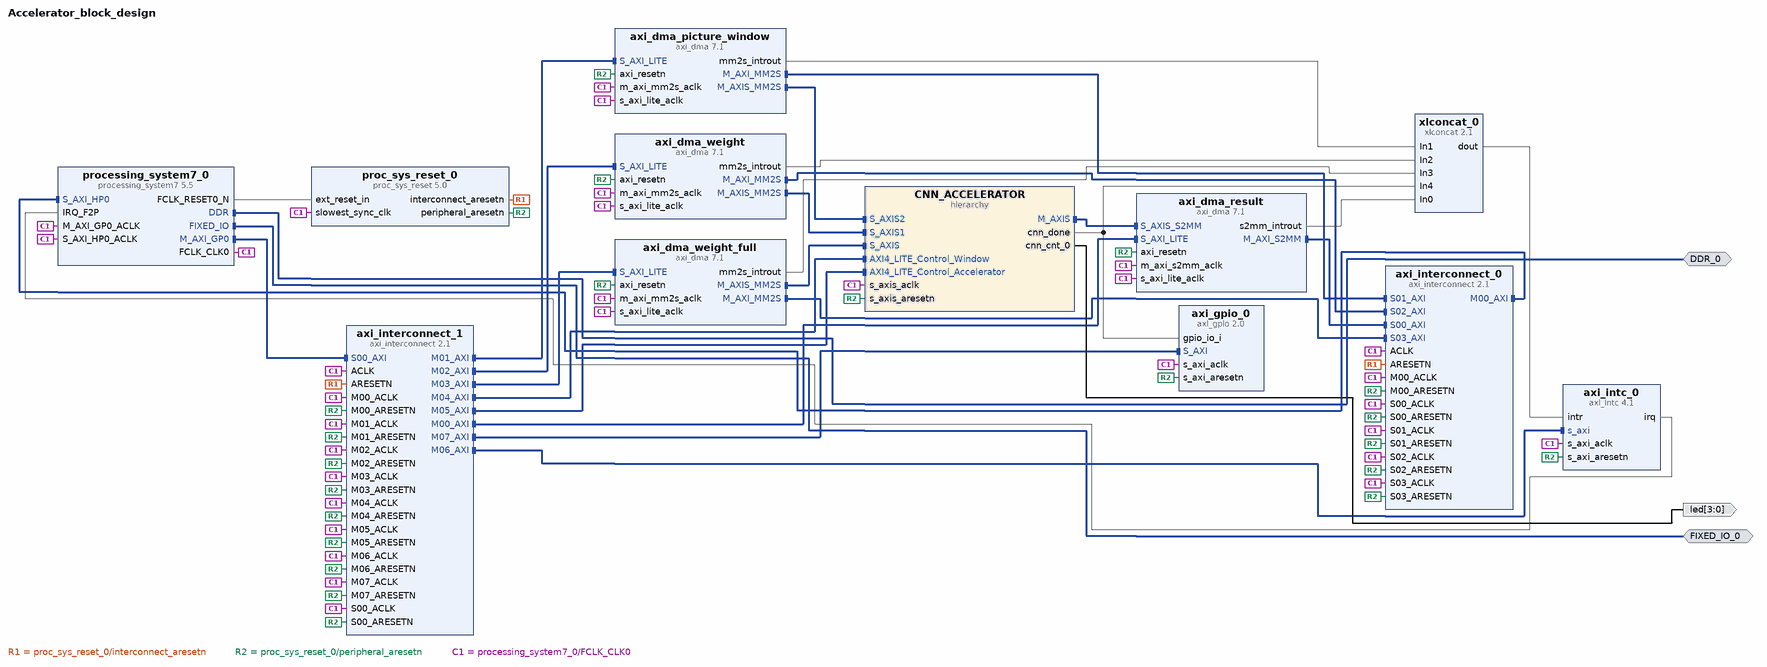
[diagram p0: block diagram of the top level]
# Vivado block design Accelerator_block_design, xc7z020clg400-1, Vivado 2022.1
create_bd_design Accelerator_block_design

create_bd_intf_port -mode Master -vlnv xilinx.com:interface:ddrx_rtl:1.0 DDR_0
create_bd_intf_port -mode Master -vlnv xilinx.com:display_processing_system7:fixedio_rtl:1.0 FIXED_IO_0
create_bd_port -dir O -from 3 -to 0 led

create_bd_cell -type ip -vlnv xilinx.com:ip:processing_system7:5.5 processing_system7_0
set_property -dict [list \
  CONFIG.PCW_APU_PERIPHERAL_FREQMHZ 666.666666 \
  CONFIG.PCW_ENET0_ENET0_IO {MIO 16 .. 27} \
  CONFIG.PCW_ENET0_GRP_MDIO_ENABLE 1 \
  CONFIG.PCW_ENET0_GRP_MDIO_IO {MIO 52 .. 53} \
  CONFIG.PCW_ENET0_PERIPHERAL_ENABLE 1 \
  CONFIG.PCW_ENET0_RESET_ENABLE 0 \
  CONFIG.PCW_ENET_RESET_ENABLE 1 \
  CONFIG.PCW_ENET_RESET_SELECT {Share reset pin} \
  CONFIG.PCW_FPGA0_PERIPHERAL_FREQMHZ 50 \
  CONFIG.PCW_GPIO_MIO_GPIO_ENABLE 1 \
  CONFIG.PCW_GPIO_MIO_GPIO_IO MIO \
  CONFIG.PCW_I2C_RESET_ENABLE 0 \
  CONFIG.PCW_IRQ_F2P_INTR 1 \
  CONFIG.PCW_PRESET_BANK1_VOLTAGE {LVCMOS 1.8V} \
  CONFIG.PCW_QSPI_GRP_FBCLK_ENABLE 1 \
  CONFIG.PCW_QSPI_GRP_FBCLK_IO {MIO 8} \
  CONFIG.PCW_QSPI_GRP_SINGLE_SS_ENABLE 1 \
  CONFIG.PCW_QSPI_GRP_SINGLE_SS_IO {MIO 1 .. 6} \
  CONFIG.PCW_QSPI_PERIPHERAL_ENABLE 1 \
  CONFIG.PCW_QSPI_QSPI_IO {MIO 1 .. 6} \
  CONFIG.PCW_SD0_GRP_CD_ENABLE 0 \
  CONFIG.PCW_SD0_GRP_WP_ENABLE 0 \
  CONFIG.PCW_SD0_PERIPHERAL_ENABLE 1 \
  CONFIG.PCW_SD0_SD0_IO {MIO 40 .. 45} \
  CONFIG.PCW_SDIO_PERIPHERAL_FREQMHZ 100 \
  CONFIG.PCW_SINGLE_QSPI_DATA_MODE x4 \
  CONFIG.PCW_UART0_PERIPHERAL_ENABLE 1 \
  CONFIG.PCW_UART0_UART0_IO {MIO 14 .. 15} \
  CONFIG.PCW_UART1_PERIPHERAL_ENABLE 0 \
  CONFIG.PCW_UART_PERIPHERAL_FREQMHZ 100 \
  CONFIG.PCW_UIPARAM_DDR_BUS_WIDTH {16 Bit} \
  CONFIG.PCW_UIPARAM_DDR_FREQ_MHZ 525 \
  CONFIG.PCW_UIPARAM_DDR_PARTNO Custom \
  CONFIG.PCW_USB0_PERIPHERAL_ENABLE 1 \
  CONFIG.PCW_USB0_RESET_ENABLE 0 \
  CONFIG.PCW_USB0_USB0_IO {MIO 28 .. 39} \
  CONFIG.PCW_USB_RESET_ENABLE 1 \
  CONFIG.PCW_USB_RESET_SELECT {Share reset pin} \
  CONFIG.PCW_USE_FABRIC_INTERRUPT 1 \
  CONFIG.PCW_USE_S_AXI_HP0 1 \
] [get_bd_cells processing_system7_0]
# 226 more settings of processing_system7_0 are not shown: defaults, MIO pin electricals, DDR timing, and values the tool derives
create_bd_cell -type ip -vlnv xilinx.com:ip:axi_interconnect:2.1 axi_interconnect_0
set_property -dict [list \
  CONFIG.ENABLE_ADVANCED_OPTIONS 1 \
  CONFIG.M00_HAS_DATA_FIFO 0 \
  CONFIG.NUM_MI 1 \
  CONFIG.NUM_SI 4 \
  CONFIG.S00_ARB_PRIORITY 15 \
  CONFIG.S00_HAS_DATA_FIFO 2 \
  CONFIG.S00_HAS_REGSLICE 3 \
  CONFIG.S01_HAS_DATA_FIFO 0 \
  CONFIG.S02_HAS_DATA_FIFO 0 \
  CONFIG.S03_HAS_DATA_FIFO 0 \
  CONFIG.STRATEGY 0 \
  CONFIG.XBAR_DATA_WIDTH 128 \
] [get_bd_cells axi_interconnect_0]
create_bd_cell -type ip -vlnv xilinx.com:ip:axi_interconnect:2.1 axi_interconnect_1
set_property -dict {CONFIG.NUM_MI 8 CONFIG.NUM_SI 1} [get_bd_cells axi_interconnect_1]
create_bd_cell -type ip -vlnv xilinx.com:ip:axi_dma:7.1 axi_dma_result
set_property -dict [list \
  CONFIG.c_include_mm2s 0 \
  CONFIG.c_include_s2mm 1 \
  CONFIG.c_include_sg 0 \
  CONFIG.c_m_axis_mm2s_tdata_width 32 \
  CONFIG.c_s2mm_burst_size 64 \
  CONFIG.c_sg_length_width 26 \
  CONFIG.c_sg_use_stsapp_length 0 \
] [get_bd_cells axi_dma_result]
create_bd_cell -type ip -vlnv xilinx.com:ip:axi_dma:7.1 axi_dma_picture_window
set_property -dict [list \
  CONFIG.c_include_mm2s 1 \
  CONFIG.c_include_s2mm 0 \
  CONFIG.c_include_sg 0 \
  CONFIG.c_m_axis_mm2s_tdata_width 8 \
  CONFIG.c_mm2s_burst_size 8 \
  CONFIG.c_sg_length_width 16 \
] [get_bd_cells axi_dma_picture_window]
create_bd_cell -type ip -vlnv xilinx.com:ip:axi_dma:7.1 axi_dma_weight
set_property -dict [list \
  CONFIG.c_include_mm2s 1 \
  CONFIG.c_include_s2mm 0 \
  CONFIG.c_include_sg 0 \
  CONFIG.c_m_axi_mm2s_data_width 128 \
  CONFIG.c_m_axis_mm2s_tdata_width 64 \
  CONFIG.c_mm2s_burst_size 64 \
  CONFIG.c_sg_length_width 16 \
] [get_bd_cells axi_dma_weight]
create_bd_cell -type ip -vlnv xilinx.com:ip:axi_dma:7.1 axi_dma_weight_full
set_property -dict [list \
  CONFIG.c_include_mm2s 1 \
  CONFIG.c_include_s2mm 0 \
  CONFIG.c_include_sg 0 \
  CONFIG.c_m_axi_mm2s_data_width 128 \
  CONFIG.c_m_axis_mm2s_tdata_width 64 \
  CONFIG.c_mm2s_burst_size 64 \
  CONFIG.c_sg_length_width 16 \
] [get_bd_cells axi_dma_weight_full]
create_bd_cell -type ip -vlnv xilinx.com:ip:proc_sys_reset:5.0 proc_sys_reset_0
create_bd_cell -type ip -vlnv xilinx.com:ip:xlconcat:2.1 xlconcat_0
set_property -dict {CONFIG.NUM_PORTS 5} [get_bd_cells xlconcat_0]
create_bd_cell -type hier CNN_ACCELERATOR
create_bd_cell -type ip -vlnv xilinx.com:ip:axi_intc:4.1 axi_intc_0
set_property -dict [list \
  CONFIG.C_IRQ_CONNECTION 1 \
  CONFIG.C_KIND_OF_INTR 0xFFFFFFFF \
  CONFIG.C_NUM_SW_INTR 0 \
  CONFIG.C_S_AXI_ACLK_FREQ_MHZ 100.0 \
] [get_bd_cells axi_intc_0]
create_bd_cell -type ip -vlnv xilinx.com:ip:axi_gpio:2.0 axi_gpio_0
set_property -dict {CONFIG.C_ALL_INPUTS 1 CONFIG.C_GPIO_WIDTH 1 CONFIG.C_INTERRUPT_PRESENT 1} [get_bd_cells axi_gpio_0]

# ---- hierarchy /CNN_ACCELERATOR ----
current_bd_instance /CNN_ACCELERATOR
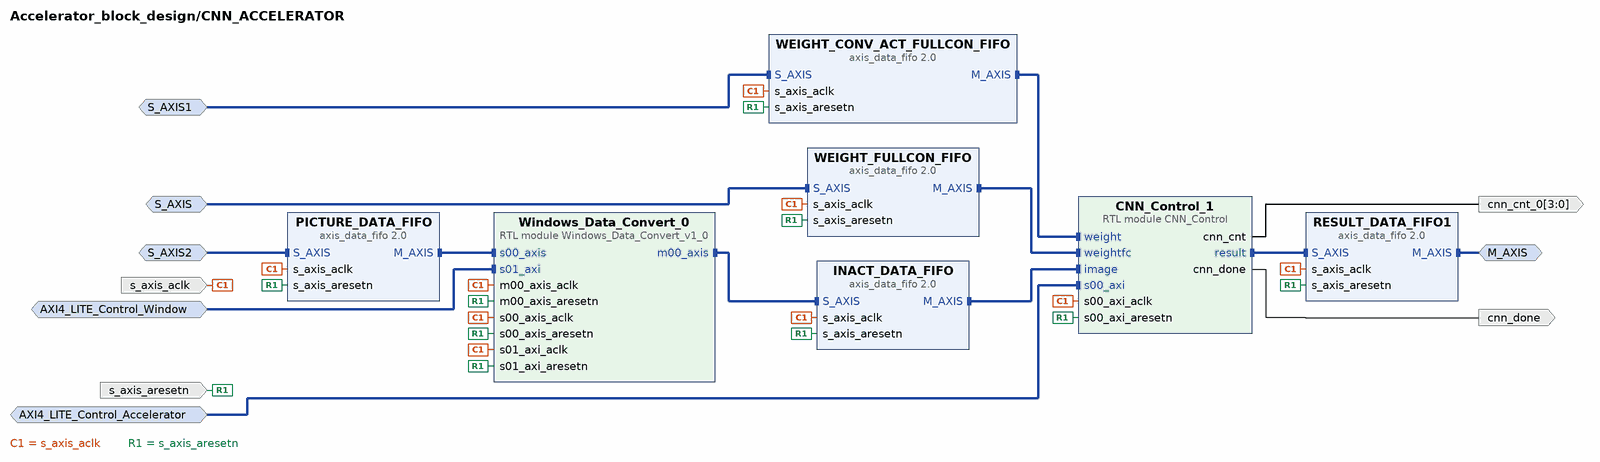
[diagram p1: block diagram inside /CNN_ACCELERATOR]
create_bd_intf_pin -mode Master -vlnv xilinx.com:interface:axis_rtl:1.0 M_AXIS
create_bd_intf_pin -mode Slave -vlnv xilinx.com:interface:aximm_rtl:1.0 AXI4_LITE_Control_Accelerator
create_bd_intf_pin -mode Slave -vlnv xilinx.com:interface:axis_rtl:1.0 S_AXIS
create_bd_intf_pin -mode Slave -vlnv xilinx.com:interface:axis_rtl:1.0 S_AXIS1
create_bd_intf_pin -mode Slave -vlnv xilinx.com:interface:aximm_rtl:1.0 AXI4_LITE_Control_Window
create_bd_intf_pin -mode Slave -vlnv xilinx.com:interface:axis_rtl:1.0 S_AXIS2
create_bd_pin -dir I -type rst s_axis_aresetn
create_bd_pin -dir I -type clk s_axis_aclk
create_bd_pin -dir O cnn_done
create_bd_pin -dir O -from 3 -to 0 cnn_cnt_0

create_bd_cell -type ip -vlnv xilinx.com:ip:axis_data_fifo:2.0 RESULT_DATA_FIFO1
set_property -dict [list \
  CONFIG.FIFO_DEPTH 2048 \
  CONFIG.HAS_TKEEP 0 \
  CONFIG.HAS_TLAST 1 \
  CONFIG.HAS_TSTRB 0 \
  CONFIG.TDATA_NUM_BYTES 32 \
] [get_bd_cells RESULT_DATA_FIFO1]
create_bd_cell -type ip -vlnv xilinx.com:ip:axis_data_fifo:2.0 WEIGHT_FULLCON_FIFO
set_property -dict [list \
  CONFIG.FIFO_DEPTH 512 \
  CONFIG.HAS_TKEEP 1 \
  CONFIG.HAS_TLAST 1 \
  CONFIG.HAS_TSTRB 1 \
  CONFIG.TDATA_NUM_BYTES 8 \
] [get_bd_cells WEIGHT_FULLCON_FIFO]
create_bd_cell -type ip -vlnv xilinx.com:ip:axis_data_fifo:2.0 WEIGHT_CONV_ACT_FULLCON_FIFO
set_property -dict [list \
  CONFIG.FIFO_DEPTH 512 \
  CONFIG.HAS_TKEEP 1 \
  CONFIG.HAS_TLAST 1 \
  CONFIG.HAS_TSTRB 1 \
  CONFIG.TDATA_NUM_BYTES 8 \
] [get_bd_cells WEIGHT_CONV_ACT_FULLCON_FIFO]
create_bd_cell -type ip -vlnv xilinx.com:ip:axis_data_fifo:2.0 INACT_DATA_FIFO
set_property -dict [list \
  CONFIG.FIFO_DEPTH 1024 \
  CONFIG.HAS_TKEEP 1 \
  CONFIG.HAS_TLAST 1 \
  CONFIG.HAS_TSTRB 1 \
  CONFIG.TDATA_NUM_BYTES 25 \
] [get_bd_cells INACT_DATA_FIFO]
create_bd_cell -type ip -vlnv xilinx.com:ip:axis_data_fifo:2.0 PICTURE_DATA_FIFO
set_property -dict {CONFIG.FIFO_DEPTH 1024} [get_bd_cells PICTURE_DATA_FIFO]
create_bd_cell -type module -reference Windows_Data_Convert_v1_0 Windows_Data_Convert_0
set_property -dict [list \
  CONFIG.AXIS_TDATA_WIDTH 8 \
  CONFIG.DATA_HORIZONTAL 28 \
  CONFIG.DATA_VERTICAL 28 \
  CONFIG.KERNEL_SIZE 5 \
] [get_bd_cells Windows_Data_Convert_0]
create_bd_cell -type module -reference CNN_Control CNN_Control_1
set_property -dict [list \
  CONFIG.CONV_KERNEL_NUM 8 \
  CONFIG.CONV_KERNEL_SIZE 5 \
  CONFIG.FULLCON_INPUT_SIZE 192 \
  CONFIG.FULLCON_OUTPUT_SIZE 8 \
  CONFIG.POOL_KERNEL_SIZE 2 \
  CONFIG.RESULT_NUM 8 \
] [get_bd_cells CNN_Control_1]

# ---- connections ----

current_bd_instance /CNN_ACCELERATOR
connect_bd_intf_net -intf_net CNN_Control_0_result [get_bd_intf_pins CNN_Control_1/result] [get_bd_intf_pins RESULT_DATA_FIFO1/S_AXIS]
connect_bd_intf_net [get_bd_intf_pins M_AXIS] [get_bd_intf_pins RESULT_DATA_FIFO1/M_AXIS]
connect_bd_intf_net [get_bd_intf_pins S_AXIS2] [get_bd_intf_pins PICTURE_DATA_FIFO/S_AXIS]
connect_bd_intf_net [get_bd_intf_pins S_AXIS] [get_bd_intf_pins WEIGHT_FULLCON_FIFO/S_AXIS]
connect_bd_intf_net [get_bd_intf_pins S_AXIS1] [get_bd_intf_pins WEIGHT_CONV_ACT_FULLCON_FIFO/S_AXIS]
connect_bd_intf_net [get_bd_intf_pins AXI4_LITE_Control_Window] [get_bd_intf_pins Windows_Data_Convert_0/s01_axi]
connect_bd_intf_net -intf_net INACT_DATA_FIFO_M_AXIS [get_bd_intf_pins INACT_DATA_FIFO/M_AXIS] [get_bd_intf_pins CNN_Control_1/image]
connect_bd_intf_net [get_bd_intf_pins Windows_Data_Convert_0/s00_axis] [get_bd_intf_pins PICTURE_DATA_FIFO/M_AXIS]
connect_bd_intf_net -intf_net WEIGHT_CONV_ACT_FULLCON_FIFO_M_AXIS [get_bd_intf_pins WEIGHT_CONV_ACT_FULLCON_FIFO/M_AXIS] [get_bd_intf_pins CNN_Control_1/weight]
connect_bd_intf_net [get_bd_intf_pins WEIGHT_FULLCON_FIFO/M_AXIS] [get_bd_intf_pins CNN_Control_1/weightfc]
connect_bd_intf_net [get_bd_intf_pins INACT_DATA_FIFO/S_AXIS] [get_bd_intf_pins Windows_Data_Convert_0/m00_axis]
connect_bd_intf_net [get_bd_intf_pins AXI4_LITE_Control_Accelerator] [get_bd_intf_pins CNN_Control_1/s00_axi]
connect_bd_net [get_bd_pins CNN_Control_1/cnn_cnt] [get_bd_pins cnn_cnt_0]
connect_bd_net [get_bd_pins CNN_Control_1/cnn_done] [get_bd_pins cnn_done]
connect_bd_net [get_bd_pins s_axis_aclk] \
  [get_bd_pins INACT_DATA_FIFO/s_axis_aclk] [get_bd_pins WEIGHT_CONV_ACT_FULLCON_FIFO/s_axis_aclk] \
  [get_bd_pins WEIGHT_FULLCON_FIFO/s_axis_aclk] [get_bd_pins RESULT_DATA_FIFO1/s_axis_aclk] \
  [get_bd_pins PICTURE_DATA_FIFO/s_axis_aclk] [get_bd_pins Windows_Data_Convert_0/s01_axi_aclk] \
  [get_bd_pins Windows_Data_Convert_0/s00_axis_aclk] [get_bd_pins Windows_Data_Convert_0/m00_axis_aclk] \
  [get_bd_pins CNN_Control_1/s00_axi_aclk]
connect_bd_net [get_bd_pins s_axis_aresetn] \
  [get_bd_pins INACT_DATA_FIFO/s_axis_aresetn] [get_bd_pins WEIGHT_CONV_ACT_FULLCON_FIFO/s_axis_aresetn] \
  [get_bd_pins WEIGHT_FULLCON_FIFO/s_axis_aresetn] [get_bd_pins RESULT_DATA_FIFO1/s_axis_aresetn] \
  [get_bd_pins PICTURE_DATA_FIFO/s_axis_aresetn] [get_bd_pins Windows_Data_Convert_0/s01_axi_aresetn] \
  [get_bd_pins Windows_Data_Convert_0/s00_axis_aresetn] [get_bd_pins Windows_Data_Convert_0/m00_axis_aresetn] \
  [get_bd_pins CNN_Control_1/s00_axi_aresetn]
set_property HDL_ATTRIBUTE.DEBUG true [get_bd_intf_nets CNN_Control_0_result]
set_property HDL_ATTRIBUTE.MARK_DEBUG true [get_bd_intf_nets CNN_Control_0_result]
set_property HDL_ATTRIBUTE.DEBUG true [get_bd_intf_nets INACT_DATA_FIFO_M_AXIS]
set_property HDL_ATTRIBUTE.MARK_DEBUG true [get_bd_intf_nets INACT_DATA_FIFO_M_AXIS]
set_property HDL_ATTRIBUTE.DEBUG true [get_bd_intf_nets WEIGHT_CONV_ACT_FULLCON_FIFO_M_AXIS]
set_property HDL_ATTRIBUTE.MARK_DEBUG true [get_bd_intf_nets WEIGHT_CONV_ACT_FULLCON_FIFO_M_AXIS]

current_bd_instance /
connect_bd_intf_net [get_bd_intf_pins axi_dma_result/S_AXIS_S2MM] [get_bd_intf_pins CNN_ACCELERATOR/M_AXIS]
connect_bd_intf_net -intf_net axi_dma_0_M_AXI_S2MM [get_bd_intf_pins axi_dma_result/M_AXI_S2MM] [get_bd_intf_pins axi_interconnect_0/S00_AXI]
connect_bd_intf_net -intf_net axi_dma_1_M_AXIS_MM2S [get_bd_intf_pins axi_dma_picture_window/M_AXIS_MM2S] [get_bd_intf_pins CNN_ACCELERATOR/S_AXIS2]
connect_bd_intf_net -intf_net axi_dma_1_M_AXI_MM2S [get_bd_intf_pins axi_dma_picture_window/M_AXI_MM2S] [get_bd_intf_pins axi_interconnect_0/S01_AXI]
connect_bd_intf_net -intf_net axi_dma_2_M_AXIS_MM2S [get_bd_intf_pins axi_dma_weight/M_AXIS_MM2S] [get_bd_intf_pins CNN_ACCELERATOR/S_AXIS1]
connect_bd_intf_net -intf_net axi_dma_2_M_AXI_MM2S [get_bd_intf_pins axi_dma_weight/M_AXI_MM2S] [get_bd_intf_pins axi_interconnect_0/S02_AXI]
connect_bd_intf_net -intf_net axi_dma_3_M_AXIS_MM2S [get_bd_intf_pins axi_dma_weight_full/M_AXIS_MM2S] [get_bd_intf_pins CNN_ACCELERATOR/S_AXIS]
connect_bd_intf_net -intf_net axi_dma_3_M_AXI_MM2S [get_bd_intf_pins axi_dma_weight_full/M_AXI_MM2S] [get_bd_intf_pins axi_interconnect_0/S03_AXI]
connect_bd_intf_net [get_bd_intf_pins axi_interconnect_0/M00_AXI] [get_bd_intf_pins processing_system7_0/S_AXI_HP0]
connect_bd_intf_net [get_bd_intf_pins axi_dma_result/S_AXI_LITE] [get_bd_intf_pins axi_interconnect_1/M00_AXI]
connect_bd_intf_net [get_bd_intf_pins axi_interconnect_1/M01_AXI] [get_bd_intf_pins axi_dma_picture_window/S_AXI_LITE]
connect_bd_intf_net [get_bd_intf_pins axi_interconnect_1/M02_AXI] [get_bd_intf_pins axi_dma_weight/S_AXI_LITE]
connect_bd_intf_net [get_bd_intf_pins axi_interconnect_1/M03_AXI] [get_bd_intf_pins axi_dma_weight_full/S_AXI_LITE]
connect_bd_intf_net [get_bd_intf_pins axi_interconnect_1/M04_AXI] [get_bd_intf_pins CNN_ACCELERATOR/AXI4_LITE_Control_Window]
connect_bd_intf_net [get_bd_intf_pins axi_interconnect_1/M05_AXI] [get_bd_intf_pins CNN_ACCELERATOR/AXI4_LITE_Control_Accelerator]
connect_bd_intf_net [get_bd_intf_pins axi_interconnect_1/M06_AXI] [get_bd_intf_pins axi_intc_0/s_axi]
connect_bd_intf_net [get_bd_intf_pins axi_interconnect_1/M07_AXI] [get_bd_intf_pins axi_gpio_0/S_AXI]
connect_bd_intf_net [get_bd_intf_ports DDR_0] [get_bd_intf_pins processing_system7_0/DDR]
connect_bd_intf_net [get_bd_intf_ports FIXED_IO_0] [get_bd_intf_pins processing_system7_0/FIXED_IO]
connect_bd_intf_net [get_bd_intf_pins processing_system7_0/M_AXI_GP0] [get_bd_intf_pins axi_interconnect_1/S00_AXI]
connect_bd_net -net ARESETN_1 [get_bd_pins proc_sys_reset_0/interconnect_aresetn] \
  [get_bd_pins axi_interconnect_0/ARESETN] [get_bd_pins axi_interconnect_1/ARESETN]
connect_bd_net [get_bd_pins CNN_ACCELERATOR/cnn_cnt_0] [get_bd_ports led]
connect_bd_net [get_bd_pins CNN_ACCELERATOR/cnn_done] [get_bd_pins xlconcat_0/In4] [get_bd_pins axi_gpio_0/gpio_io_i]
connect_bd_net -net M00_ARESETN_1 [get_bd_pins proc_sys_reset_0/peripheral_aresetn] \
  [get_bd_pins axi_interconnect_0/M00_ARESETN] [get_bd_pins axi_interconnect_0/S00_ARESETN] \
  [get_bd_pins axi_interconnect_0/S01_ARESETN] [get_bd_pins axi_interconnect_0/S02_ARESETN] \
  [get_bd_pins axi_interconnect_0/S03_ARESETN] [get_bd_pins axi_dma_result/axi_resetn] \
  [get_bd_pins axi_dma_picture_window/axi_resetn] [get_bd_pins axi_dma_weight/axi_resetn] \
  [get_bd_pins axi_dma_weight_full/axi_resetn] [get_bd_pins axi_interconnect_1/S00_ARESETN] \
  [get_bd_pins axi_interconnect_1/M00_ARESETN] [get_bd_pins axi_interconnect_1/M05_ARESETN] \
  [get_bd_pins axi_interconnect_1/M01_ARESETN] [get_bd_pins axi_interconnect_1/M02_ARESETN] \
  [get_bd_pins axi_interconnect_1/M03_ARESETN] [get_bd_pins axi_interconnect_1/M04_ARESETN] \
  [get_bd_pins CNN_ACCELERATOR/s_axis_aresetn] [get_bd_pins axi_intc_0/s_axi_aresetn] \
  [get_bd_pins axi_interconnect_1/M06_ARESETN] [get_bd_pins axi_interconnect_1/M07_ARESETN] \
  [get_bd_pins axi_gpio_0/s_axi_aresetn]
connect_bd_net -net axi_dma_0_s2mm_introut [get_bd_pins axi_dma_result/s2mm_introut] [get_bd_pins xlconcat_0/In0]
connect_bd_net -net axi_dma_1_mm2s_introut [get_bd_pins axi_dma_picture_window/mm2s_introut] [get_bd_pins xlconcat_0/In1]
connect_bd_net -net axi_dma_2_mm2s_introut [get_bd_pins axi_dma_weight/mm2s_introut] [get_bd_pins xlconcat_0/In2]
connect_bd_net -net axi_dma_3_mm2s_introut [get_bd_pins axi_dma_weight_full/mm2s_introut] [get_bd_pins xlconcat_0/In3]
connect_bd_net [get_bd_pins axi_intc_0/irq] [get_bd_pins processing_system7_0/IRQ_F2P]
connect_bd_net [get_bd_pins processing_system7_0/FCLK_CLK0] \
  [get_bd_pins axi_interconnect_0/ACLK] [get_bd_pins axi_interconnect_0/S00_ACLK] [get_bd_pins axi_interconnect_0/M00_ACLK] \
  [get_bd_pins axi_interconnect_0/S01_ACLK] [get_bd_pins axi_interconnect_0/S02_ACLK] \
  [get_bd_pins axi_interconnect_0/S03_ACLK] [get_bd_pins proc_sys_reset_0/slowest_sync_clk] \
  [get_bd_pins processing_system7_0/M_AXI_GP0_ACLK] [get_bd_pins axi_dma_result/s_axi_lite_aclk] \
  [get_bd_pins axi_dma_picture_window/s_axi_lite_aclk] [get_bd_pins axi_dma_weight/s_axi_lite_aclk] \
  [get_bd_pins axi_dma_weight_full/s_axi_lite_aclk] [get_bd_pins axi_interconnect_1/ACLK] \
  [get_bd_pins axi_dma_picture_window/m_axi_mm2s_aclk] [get_bd_pins axi_dma_result/m_axi_s2mm_aclk] \
  [get_bd_pins axi_interconnect_1/S00_ACLK] [get_bd_pins processing_system7_0/S_AXI_HP0_ACLK] \
  [get_bd_pins axi_interconnect_1/M00_ACLK] [get_bd_pins axi_dma_weight/m_axi_mm2s_aclk] \
  [get_bd_pins axi_dma_weight_full/m_axi_mm2s_aclk] [get_bd_pins axi_interconnect_1/M01_ACLK] \
  [get_bd_pins axi_interconnect_1/M02_ACLK] [get_bd_pins axi_interconnect_1/M03_ACLK] \
  [get_bd_pins axi_interconnect_1/M04_ACLK] [get_bd_pins axi_interconnect_1/M05_ACLK] \
  [get_bd_pins CNN_ACCELERATOR/s_axis_aclk] [get_bd_pins axi_intc_0/s_axi_aclk] [get_bd_pins axi_interconnect_1/M06_ACLK] \
  [get_bd_pins axi_interconnect_1/M07_ACLK] [get_bd_pins axi_gpio_0/s_axi_aclk]
connect_bd_net [get_bd_pins processing_system7_0/FCLK_RESET0_N] [get_bd_pins proc_sys_reset_0/ext_reset_in]
connect_bd_net [get_bd_pins xlconcat_0/dout] [get_bd_pins axi_intc_0/intr]

# ---- address map ----
assign_bd_address -offset 0x00000000 -range 512M -target_address_space [get_bd_addr_spaces axi_dma_picture_window/Data_MM2S] [get_bd_addr_segs processing_system7_0/S_AXI_HP0/HP0_DDR_LOWOCM]
assign_bd_address -offset 0x00000000 -range 512M -target_address_space [get_bd_addr_spaces axi_dma_result/Data_S2MM] [get_bd_addr_segs processing_system7_0/S_AXI_HP0/HP0_DDR_LOWOCM]
assign_bd_address -offset 0x00000000 -range 512M -target_address_space [get_bd_addr_spaces axi_dma_weight/Data_MM2S] [get_bd_addr_segs processing_system7_0/S_AXI_HP0/HP0_DDR_LOWOCM]
assign_bd_address -offset 0x00000000 -range 512M -target_address_space [get_bd_addr_spaces axi_dma_weight_full/Data_MM2S] [get_bd_addr_segs processing_system7_0/S_AXI_HP0/HP0_DDR_LOWOCM]
assign_bd_address -offset 0x40000000 -range 4K -target_address_space [get_bd_addr_spaces processing_system7_0/Data] [get_bd_addr_segs CNN_ACCELERATOR/CNN_Control_1/s00_axi/reg0]
assign_bd_address -offset 0x40001000 -range 4K -target_address_space [get_bd_addr_spaces processing_system7_0/Data] [get_bd_addr_segs CNN_ACCELERATOR/Windows_Data_Convert_0/s01_axi/reg0]
assign_bd_address -offset 0x40400000 -range 64K -target_address_space [get_bd_addr_spaces processing_system7_0/Data] [get_bd_addr_segs axi_dma_result/S_AXI_LITE/Reg]
assign_bd_address -offset 0x40410000 -range 64K -target_address_space [get_bd_addr_spaces processing_system7_0/Data] [get_bd_addr_segs axi_dma_picture_window/S_AXI_LITE/Reg]
assign_bd_address -offset 0x40420000 -range 64K -target_address_space [get_bd_addr_spaces processing_system7_0/Data] [get_bd_addr_segs axi_dma_weight/S_AXI_LITE/Reg]
assign_bd_address -offset 0x40430000 -range 64K -target_address_space [get_bd_addr_spaces processing_system7_0/Data] [get_bd_addr_segs axi_dma_weight_full/S_AXI_LITE/Reg]
assign_bd_address -offset 0x41200000 -range 64K -target_address_space [get_bd_addr_spaces processing_system7_0/Data] [get_bd_addr_segs axi_gpio_0/S_AXI/Reg]
assign_bd_address -offset 0x41800000 -range 64K -target_address_space [get_bd_addr_spaces processing_system7_0/Data] [get_bd_addr_segs axi_intc_0/S_AXI/Reg]

validate_bd_design
save_bd_design
